# Altium project Mainboard.PrjPcb (part 2 of 2)

## Sheet Power.SchDoc: Наименование
size 420 x 297 mm; ApprovedBy: Утвердил; CheckedBy: Проверил; Author: Разработал; CompanyName: Организация; DrawnBy: Н.Контр; Engineer: Т.Контр; SheetNumber: 1; SheetTotal: 1; PageSetup: Record=PageOptions|CenterHorizontal=True|CenterVertical=True|PrintScale=0.94|XCorrection=1.00|YCorrection=1.00|PrintKind=1|BorderSize=5000000|LeftOffset=0|BottomOffset=0|Orientation=1|PaperLength=1000|PaperWidth=1000|Scale=100|PaperSource=7|PrintQuality=-4|MediaType=1|DitherType=10|PaperKind=A4|PrintScaleMode=1; DecimalNumber: Power; HeadOfSector: Нач. сектора; MainDevice: Перв.примен.; Name: Наименование; DocumentName: Sheet1.SCHDOC
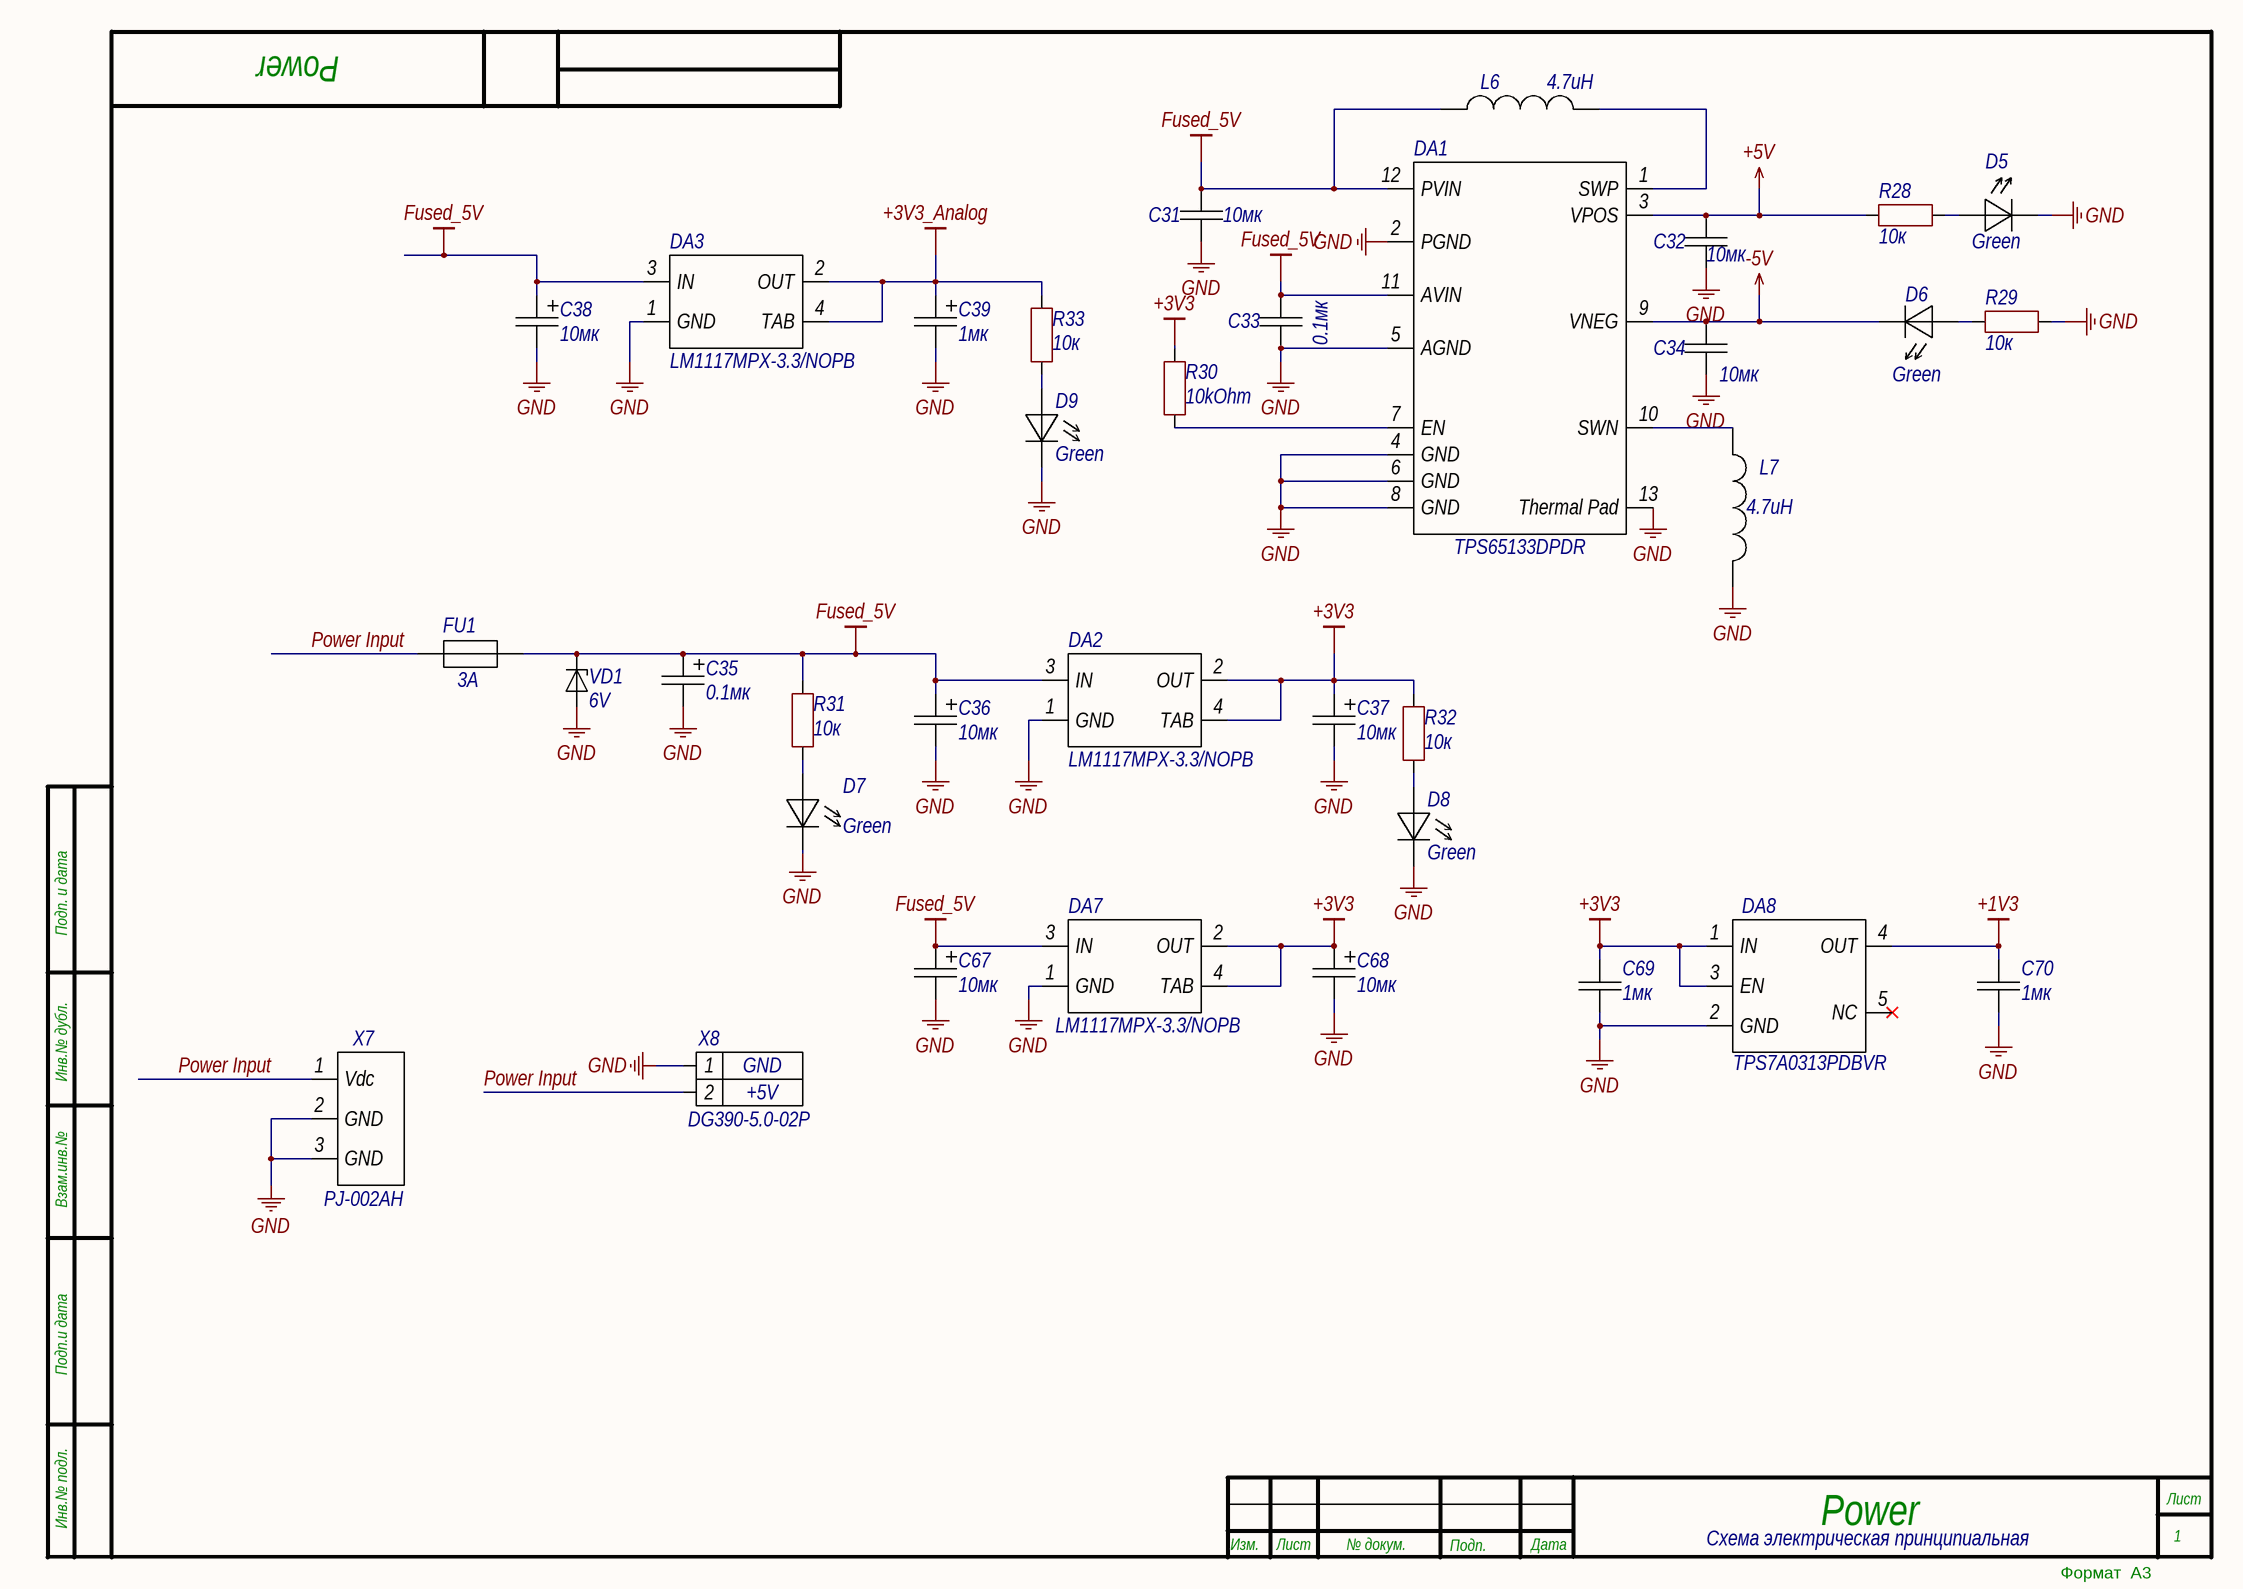
[diagram p5: Power.SchDoc]

### Parts
C31  value 10мк  [CAPC3216N]  (hidden comment: 10мк *)
C32  value 10мк  [CAPC3216N]  (hidden comment: 10мк *)
C33  value 0.1мк  [CAPC3216N]  (hidden comment: 0.1мк *)
C34  value 10мк  [CAPC3216N]  (hidden comment: 10мк *)
C35  value 0.1мк  [TYPEB]  (hidden comment: 0.1мк 10V)
C36  value 10мк  [TYPEA]  (hidden comment: 10мк 16V)
C37  value 10мк  [TYPEA]  (hidden comment: 10мк 16V)
C38  value 10мк  [TYPEA]  (hidden comment: 10мк 16V)
C39  value 1мк  [TYPEA]  (hidden comment: 1мк 16V)
C67  10мк  [TYPEA]
C68  10мк  [TYPEA]
C69  value 1мк  [CAP0402]  (hidden comment: 1мк *)
C70  value 1мк  [CAP0402]  (hidden comment: 1мк *)
D5  Green  [LED603]
D6  Green  [LED603]
D7  Green  [LED603]
D8  Green  [LED603]
D9  Green  [LED603]
DA1  TPS65133DPDR  [FP-DPD0012A-IPC_A]
DA2  MPN: LM1117MPX-3.3/NOPB  [SOT-223]  (hidden comment: LDO 5V to 3V3)
DA3  MPN: LM1117MPX-3.3/NOPB  [SOT-223]  (hidden comment: LDO 5V to 3V3)
DA7  LM1117MPX-3.3/NOPB  [SOT-223]
DA8  TPS7A0313PDBVR  [SOT-23-5]
FU1  value 3A  [FP-0154-MFG]  (hidden comment: Fuse: +5V power line)
L6  4.7uH  [ind_SRN8040]
L7  4.7uH  [ind_SRN8040]
R28  10к  [RESC0603N]
R29  10к  [RESC0603N]
R30  value 10kOhm  [RESC0603N]  (hidden comment: 10kOhm 0.1W)
R31  value 10к  [RESC0603N]  (hidden comment: 10к 0.1W)
R32  10к  [RESC0603N]
R33  10к  [RESC0603N]
VD1  value 6V  [DO-214AA]  (hidden comment: TVS: +5V power line)
X7  PJ-002AH  [PJ-002AH]
X8  DG390-5.0-02P  Wire2: +5V  Wire1: GND  [DG390-5.0-02P]

### Nets
+1V3: C70.2 DA8.4(OUT)
+3V3: C37.1 C68.1 C69.2 DA2.2(OUT) DA2.4(TAB) DA7.2(OUT) DA7.4(TAB) DA8.1(IN) DA8.3(EN) R30.2 R32.2
+3V3_Analog: C39.1 DA3.2(OUT) DA3.4(TAB) R33.2
+5V: C32.2 DA1.3(VPOS) R28.1
-5V: C34.2 D6.1(A) DA1.9(VNEG)
Fused_5V: C31.2 C33.2 C35.1 C36.1 C38.1 C67.1 DA1.11(AVIN) DA1.12(PVIN) DA2.3(IN) DA3.3(IN) DA7.3(IN) FU1.2 L6.1 R31.2 VD1.1
GND: C31.1 C32.1 C33.1 C34.1 C35.2 C36.2 C37.2 C38.2 C39.2 C67.2 C68.2 C69.1 C70.1 D5.1(A) D7.1(A) D8.1(A) D9.1(A) DA1.2(PGND) DA1.4(GND) DA1.5(AGND) DA1.6(GND) DA1.8(GND) DA1.13(Thermal_Pad) DA2.1(GND) DA3.1(GND) DA7.1(GND) DA8.2(GND) L7.2 R29.2 VD1.2 X7.2(GND) X7.3(GND) X8.1
Power Input: FU1.1 X7.1(Vdc) X8.2
NetD5_2: D5.2(K) R28.2
NetD6_2: D6.2(K) R29.1
NetD7_2: D7.2(K) R31.1
NetD8_2: D8.2(K) R32.1
NetD9_2: D9.2(K) R33.1
NetDA1_1: DA1.1(SWP) L6.2
NetDA1_7: DA1.7(EN) R30.1
NetDA1_10: DA1.10(SWN) L7.1

Not connected (* = marked no-connect by the designer): DA8 5(NC)*

### Notes on the sheet
- Схема электрическая принципиальная
- Подп. и дата
- Инв.№ дубл.
- Взам.инв.№
- Подп.и дата
- Инв.№ подл.
- Изм.
- Лист
- № докум.
- Подп.
- Дата
- Формат  A3

### Library data of the parts
C31-C34 = CAPC: MntType: SMD; MSL: MSL 1; Package: =Footprint; RoHS: Comply; PartType: CHIP CERAMIC CAPACITOR; Pins: 2; BOMDescription: =MntType+' '+PartType+' '+Package+' '+Value+' '+Tolerance+' '+Voltage+' '+TempCoeff+' '+MPN; CFootprint: =Footprint; Voltage: *; Part Number: CAPC; ClassName: Capacitor; ComponentLink1Description: Datasheet
C35 = Cap TANTAL: Manufacturer: KEMET; ManufacturerAlt: JLCPCB; MPN: T491B107M010AT; MPNAlt: C90975; MntType: SMD; Tolerance: 20%; Height: 1.9mm; MSL: MSL 1; Package: =Footprint; RoHS: Comply; Weight: 107.45mg; Voltage: 10V; PartType: CHIP TANTALUM CAPACITOR; Pins: 2; BOMDescription: =MntType+' '+PartType+' '+Package+' '+Value+' '+Tolerance+' '+Voltage+' '+TempCoeff+' '+MPN; CFootprint: =Footprint; Part Number: Cap TANTAL; ClassName: Capacitor; ComponentLink1Description: Datasheet; ComponentLink1Description: New link; ComponentLink1URL: https://content.kemet.com/datasheets/KEM_T2005_T491.pdf
C36-C39 = Cap TANTAL: Manufacturer: AVX; ManufacturerAlt: JLCPCB; MPN: TAJA106K016RNJ; MPNAlt: C7171; MntType: SMD; Tolerance: 10%; Height: 1.60; MSL: MSL 1; Package: =Footprint; RoHS: Comply; Voltage: 16V; PartType: CHIP TANTALUM CAPACITOR; Pins: 2; BOMDescription: =MntType+' '+PartType+' '+Package+' '+Value+' '+Tolerance+' '+Voltage+' '+TempCoeff+' '+MPN; CFootprint: =Footprint; Part Number: Cap TANTAL; ClassName: Capacitor; ComponentLink1Description: Datasheet; ComponentLink1Description: New link; ComponentLink1URL: https://datasheets.kyocera-avx.com/TAJ.pdf
C67 C68 = Cap TANTAL: MntType: SMD; MSL: MSL 1; Package: =Footprint; RoHS: Comply; PartType: CHIP TANTALUM CAPACITOR; Pins: 2; BOMDescription: =MntType+' '+PartType+' '+Package+' '+Value+' '+Tolerance+' '+Voltage+' '+TempCoeff+' '+MPN; CFootprint: =Footprint; Value: 10мк; PART NUMBER: Cap TANTAL; CLASSNAME: Capacitor; COMPONENTLINK1DESCRIPTION: Datasheet
C69 C70 = CAP0402: MntType: SMD; MSL: MSL 1; Package: =Footprint; RoHS: Comply; PartType: CHIP CERAMIC CAPACITOR; Pins: 2; BOMDescription: =MntType+' '+PartType+' '+Package+' '+Value+' '+Tolerance+' '+Voltage+' '+TempCoeff+' '+MPN; CFootprint: =Footprint; Voltage: *; PART NUMBER: CAP0402; CLASSNAME: Capacitor; COMPONENTLINK1DESCRIPTION: Datasheet
D5 D6 D8 D9 = LEDC: MntType: SMD; MSL: MSL 5; Package: =Footprint; RoHS: Comply; PartType: CHIP LED; Pins: 2; BOMDescription: =MntType+' '+PartType+' '+Package+' '+Value+' '+Tolerance+' '+Voltage+' '+TempCoeff+' '+MPN; CFootprint: =Footprint; Value: Green; PART NUMBER: LEDC; CLASSNAME: LED; COMPONENTLINK1DESCRIPTION: Datasheet
D7 = LEDC: Manufacturer: Everlight Elec; ManufacturerAlt: JLCPCB; MPN: 19-217/GHC-YR1S2/3T; MPNAlt: C72043; MntType: SMD; Power: 110mW; Voltage: 3.3V; Height: 0.4 mm; MSL: MSL 5; Package: =Footprint; RoHS: Comply; Weight: 118.61 mg; PartType: CHIP LED; Pins: 2; BOMDescription: =MntType+' '+PartType+' '+Package+' '+Value+' '+Tolerance+' '+Voltage+' '+TempCoeff+' '+MPN; CFootprint: =Footprint; Value: Green; Part Number: LEDC; ClassName: LED; ComponentLink1Description: Datasheet; ComponentLink1Description: New link; ComponentLink1URL: https://datasheet.lcsc.com/lcsc/1811101510_Everlight-Elec-19-217-GHC-YR1S2-3T_C72043.pdf
DA1 = TPS65133DPDR: Dual-Output Power Supply; Manufacturer: TI; Number of Channels: 2; Max Supply Voltage: 5V; Min Supply Voltage: 2.9V; Output Voltage: -5V; MntType: SMD; Mount: Surface Mount; Case/Package: QFN; Packaging: Tape and Reel; Lead Free: Lead Free; Radiation Hardening: No; Min Operating Temperature: -40°C; Number of Outputs: 2; Max Operating Temperature: 85°C; Number of Pins: 12; RoHS Compliant: Yes; Package Quantity: 3000; Part Number: TPS65133DPDR; Value: TPS65133DPDR; MPN: TPS65133DPDR; MSL: MSL 1; Package: WSON; RoHS: Comply; PartType: Switch Power; Pins: 13; BOMDescription: =MntType+' '+PartType+' '+Package+' '+Value+' '+Tolerance+' '+Voltage+' '+TempCoeff+' '+MPN; CFootprint: =Footprint; ClassName: Switch Power; ComponentLink1Description: Datasheet; ComponentLink1URL: https://www.ti.com/lit/ds/symlink/tps65133.pdf?ts=1627858987235&ref_url=https%253A%252F%252Fwww.google.com%252F
DA2 DA3 = LM1117MPX-3.3/NOPB: Manufacturer: Texas Instruments; ManufacturerAlt: JLCPCB; MPNAlt: C9662; BOMDescription: SMD LDO SOT-223 3.3V  15V  LM1117MPX-3.3/NOPB; MntType: SMD; Value: 3.3V; Voltage: 15V; CFootprint: =Footprint; Height: 35.0; MSL: MSL 1; Package: SOT-223; PartType: LDO; Pins: 4; RoHS: Comply; Part Number: LM1117MPX-3.3/NOPB; Weight: 290 mg; ClassName: LDO; ComponentLink1Description: Datasheet; ComponentLink1URL: https://www.ti.com/lit/ds/symlink/lm1117.pdf
DA7 = LM1117MPX-3.3/NOPB: Manufacturer: Texas Instruments; MPNAlt: C9662; BOMDescription: SMD LDO SOT-223 3.3V  3.3V  LM1117MPX-3.3/NOPB; MntType: SMD; Value: 3.3V; CFootprint: =Footprint; Height: 1,8; MPN: LM1117MPX-3.3/NOPB; MSL: MSL 1; Package: SOT-223; PartType: LDO; Pins: 4; RoHS: Comply; Voltage: 3.3V; PART NUMBER: LM1117MPX-3.3/NOPB; WEIGHT: 290 mg; CLASSNAME: LDO; COMPONENTLINK1DESCRIPTION: Datasheet; COMPONENTLINK1URL: https://www.ti.com/lit/ds/symlink/lm1117.pdf
DA8 = TPS7A0313PDBVR: Manufacturer: TI; Value: 1.3 V; MntType: SMD; MSL: MSL 1; Package: =Footprint; RoHS: Comply; PartType: LDO; Pins: 5; BOMDescription: =MntType+' '+PartType+' '+Package+' '+Value+' '+Tolerance+' '+Voltage+' '+TempCoeff+' '+MPN; CFootprint: =Footprint; ClassName: LDO; ComponentLink1Description: Datasheet; MPN: TPS7A0313PDBVR; PART NUMBER: TPS7A0313PDBVR; COMPONENTLINK1URL: https://www.ti.com/lit/ds/symlink/tps7a03.pdf
FU1 = 0154003.DR: Manufacturer: Littelfuse; ManufacturerAlt: JLCPCB; MPNAlt: C206912; MntType: SMD; Voltage: 125 V; Part Number: 0154003.DR; MPN: 0154003.DR; Height: 3.81 mm; MSL: MSL 1; Package: OMNI-BLOK; RoHS: Comply; Weight: 819.8 mg; PartType: Fuse; Pins: 2; BOMDescription: =MntType+' '+PartType+' '+Package+' '+Value+' '+Tolerance+' '+Voltage+' '+TempCoeff+' '+MPN; CFootprint: =Footprint; ComponentLink1Description: Datasheet; ComponentLink1URL: https://www.littelfuse.com/media?resourcetype=datasheets&itemid=1cd64ad0-b793-4012-8c75-7e2fefbc1368&filename=littelfuse-fuse-154-154t-154l-154tl-datasheet.pdf
L6 L7 = SRN8040-4R7Y: Manufacturer: Bourns; MntType: SMD; MPN: SRN8040-4R7Y; MSL: MSL 1; Package: =Footprint; RoHS: Comply; PartType: INDUCTOR; Pins: 2; BOMDescription: =MntType+' '+PartType+' '+Package+' '+Value+' '+Tolerance+' '+Voltage+' '+TempCoeff+' '+MPN; CFootprint: =Footprint; Value: 4.7uH; Part Number: SRN8040-4R7Y; ClassName: Inductor; ComponentLink1Description: Datasheet; ComponentLink1URL: https://spb.terraelectronica.ru/pdf/show?pdf_file=http%253A%252F%252Fwww.farnell.com%252Fdatasheets%252F1927816.pdf
R28 R29 R32 R33 = RES: MntType: SMD; MSL: MSL 1; Package: =Footprint; RoHS: Comply; PartType: CHIP RESISTOR; Pins: 2; BOMDescription: =MntType+' '+PartType+' '+Package+' '+Value+' '+Tolerance+' '+Voltage+' '+TempCoeff+' '+MPN; CFootprint: =Footprint; Value: 10к; PART NUMBER: RES; CLASSNAME: Resistor; COMPONENTLINK1DESCRIPTION: Datasheet
R30 R31 = RES: Manufacturer: UNI-ROYAL(Uniroyal Elec); ManufacturerAlt: JLCPCB; MPN: 0603WAF1002T5E; MPNAlt: C25804; MntType: SMD; Tolerance: 1%; Voltage: 75V; Height: 0.45; MSL: MSL 1; Package: =Footprint; Power: 0.1W; RoHS: Comply; PartType: CHIP RESISTOR; Pins: 2; BOMDescription: =MntType+' '+PartType+' '+Package+' '+Value+' '+Tolerance+' '+Voltage+' '+TempCoeff+' '+MPN; CFootprint: =Footprint; Part Number: RES; ClassName: Resistor; ComponentLink1Description: Datasheet; ComponentLink1Description: New link; ComponentLink1URL: https://datasheet.lcsc.com/lcsc/1811062009_UNI-ROYAL-Uniroyal-Elec-0603WAF1002T5E_C25804.pdf
VD1 = SMBJ6.0A: Manufacturer: RUILON(Shenzhen Ruilongyuan Elec); ManufacturerAlt: JLCPCB; MPNAlt: C10205; MntType: SMD; Power: 5W; Tolerance: 5%; Part Number: SMBJ6.0A; MPN: SMBJ6.0A; Height: 2.610 mm; MSL: MSL 1; Package: DO-214AA; RoHS: Comply; Weight: 93 mg; Voltage: 6V; PartType: Diode_zener; Pins: 2; BOMDescription: =MntType+' '+PartType+' '+Package+' '+Value+' '+Tolerance+' '+Voltage+' '+TempCoeff+' '+MPN; CFootprint: =Footprint; ClassName: Diode_zener; ComponentLink1Description: Datasheet; ComponentLink1URL: https://www.littelfuse.com/~/media/electronics/datasheets/tvs_diodes/littelfuse_tvs_diode_smbj_datasheet.pdf.pdf; ComponentLink2Description: Datasheet 2; ComponentLink2URL: https://datasheet.lcsc.com/lcsc/1809050331_RUILON-Shenzhen-Ruilongyuan-Elec-SMBJ6.0A_C10205.pdf
X7 = CUI_PJ-002AH: Manufacturer: CUI; MntType: DIP; MPN: PJ-002AH; MSL: MSL 1; Package: =Footprint; RoHS: Comply; PartType: CONNECTOR; Pins: 3; BOMDescription: =MntType+' '+PartType+' '+Package+' '+Value+' '+Tolerance+' '+Voltage+' '+TempCoeff+' '+MPN; CFootprint: =Footprint; Part Number: CUI_PJ-002AH
X8 = DG390-5.0-02P: Manufacturer: DEGSON; MntType: DIP; System: Connector; Part Number: DG390-5.0-02P; Value: DG390-5.0-02P; MPN: DG390-5.0-02P; MSL: MSL 1; RoHS: Comply; PartType: CONNECTOR; Pins: 2; BOMDescription: =MntType+' '+PartType+' '+Package+' '+Value+' '+Tolerance+' '+Voltage+' '+TempCoeff+' '+MPN; CFootprint: =Footprint; ClassName: Connector; ComponentLink1Description: Datasheet; ComponentLink1URL: https://www.degson.com/content/details_552_878975.html?lang=en

## Sheet Comparator.SchDoc: Наименование
size 420 x 297 mm; ApprovedBy: Утвердил; CheckedBy: Проверил; Author: Разработал; CompanyName: Организация; DrawnBy: Н.Контр; Engineer: Т.Контр; SheetNumber: 1; SheetTotal: 1; PageSetup: Record=PageOptions|CenterHorizontal=True|CenterVertical=True|PrintScale=0.94|XCorrection=1.00|YCorrection=1.00|PrintKind=1|BorderSize=5000000|LeftOffset=0|BottomOffset=0|Orientation=1|PaperLength=1000|PaperWidth=1000|Scale=100|PaperSource=7|PrintQuality=-4|MediaType=1|DitherType=10|PaperKind=A4|PrintScaleMode=1; DecimalNumber: Comparator; HeadOfSector: Нач. сектора; MainDevice: Перв.примен.; Name: Наименование; DocumentName: Sheet1.SCHDOC
Used 2 times, as channels A13, A14. Parts and nets are listed once, with the designators drawn on the sheet.
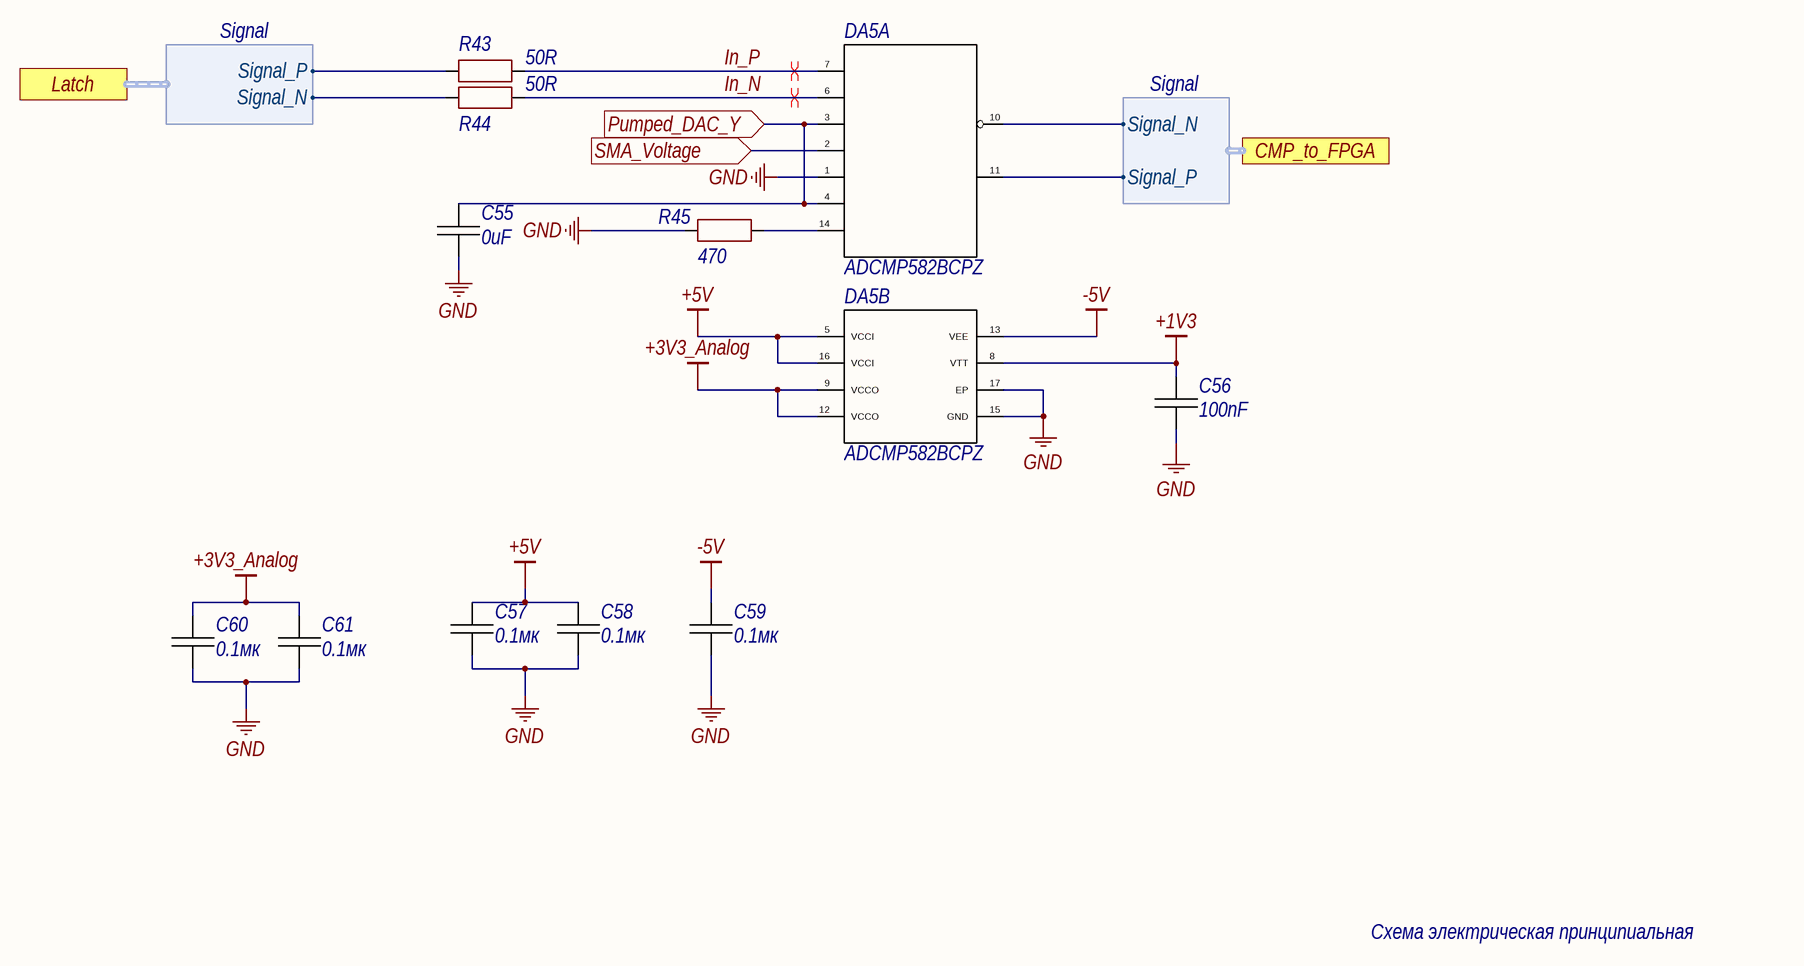
[diagram p6: Comparator.SchDoc]

### Parts
C55  value 0uF  [CAP0402]  (hidden comment: 0uF 50V)
C56  value 100nF  [CAP0402]  (hidden comment: 100nF 50V)
C57  value 0.1мк  [CAP0402]  (hidden comment: 0.1мк 50V)
C58  value 0.1мк  [CAP0402]  (hidden comment: 0.1мк 50V)
C59  value 0.1мк  [CAP0402]  (hidden comment: 0.1мк 50V)
C60  value 0.1мк  [CAP0402]  (hidden comment: 0.1мк 50V)
C61  value 0.1мк  [CAP0402]  (hidden comment: 0.1мк 50V)
DA5  (no value)  [ADI-CP-16-3_N]  (parts A,B of 2)
R43  50R  [RESC0402(1005)_M]
R44  50R  [RESC0402(1005)_M]
R45  470  [RESC0402(1005)_M]

### Ports
CMP_to_FPGA (harness Signal), Latch (harness Signal), Pumped_DAC_Y (in), SMA_Voltage (in)

### Harnesses
Signal: Signal_N, Signal_P

### Nets
+1V3: C56.2 DA5.8(VTT)
+3V3_Analog: C60.1 C61.1 DA5.9(VCCO) DA5.12(VCCO)
+5V: C57.1 C58.1 DA5.5(VCCI) DA5.16(VCCI)
-5V: C59.1 DA5.13(VEE)
GND: C55.2 C56.1 C57.2 C58.2 C59.2 C60.2 C61.2 DA5.1(VTP) DA5.15(GND) DA5.17(EP) R45.1
In_N: DA5.6(~{LE}) R44.1
In_P: DA5.7(LE) R43.1
Pumped_DAC_Y: C55.1 DA5.3(VN) DA5.4(VTN) ; port Pumped_DAC_Y
SMA_Voltage: DA5.2(VP) ; port SMA_Voltage
NetDA5_10: DA5.10(~{Q}) ; port CMP_to_FPGA.Signal_N
NetDA5_11: DA5.11(Q) ; port CMP_to_FPGA.Signal_P
NetDA5_14: DA5.14(HYS) R45.2
NetR43_2: R43.2 ; port Latch.Signal_P
NetR44_2: R44.2 ; port Latch.Signal_N

### Channels
A13: designators C55=A13.C55 C56=A13.C56 C57=A13.C57 C58=A13.C58 C59=A13.C59 C60=A13.C60 C61=A13.C61 DA5=A13.DA5 R43=A13.R43 R44=A13.R44 R45=A13.R45; ports Pumped_DAC_Y=NetA13.C55_1 SMA_Voltage=SMA_Voltage_1
A14: designators C55=A14.C55 C56=A14.C56 C57=A14.C57 C58=A14.C58 C59=A14.C59 C60=A14.C60 C61=A14.C61 DA5=A14.DA5 R43=A14.R43 R44=A14.R44 R45=A14.R45; ports Pumped_DAC_Y=NetA14.C55_1 SMA_Voltage=SMA_Voltage_2

### Layout directives
differential pair; differential pair class LVDS/PECL: In_N_A13, In_P_A13

### Notes on the sheet
- Схема электрическая принципиальная
- Подп. и дата
- Инв.№ дубл.
- Взам.инв.№
- Подп.и дата
- Инв.№ подл.
- Изм.
- Лист
- № докум.
- Подп.
- Дата
- Формат  A3

### Library data of the parts
C55-C61 = CAP0402: Manufacturer: Samsung Electro-Mechanics; ManufacturerAlt: JLCPCB; MPN: CL05B104KB54PNC; MPNAlt: C307331; MntType: SMD; Notes: Basic Part; Tolerance: 10%; Height: 0.5mm; MSL: MSL 1; Package: =Footprint; RoHS: Comply; Weight: 1.500mg; PartType: CHIP CERAMIC CAPACITOR; Pins: 2; BOMDescription: =MntType+' '+PartType+' '+Package+' '+Value+' '+Tolerance+' '+Voltage+' '+TempCoeff+' '+MPN; CFootprint: =Footprint; Voltage: 50V; Part Number: CAP0402; ClassName: Capacitor; ComponentLink1Description: Datasheet; ComponentLink1Description: New link; ComponentLink1URL: https://datasheet.lcsc.com/lcsc/1810191222_Samsung-Electro-Mechanics-CL05B104KB54PNC_C307331.pdf
DA5 = ADCMP582BCPZ: Ultrafast SiGe Voltage Comparator, + / - 5 V, 180 ps Delay, Industrial, 16-pin QFN (CP-16-3), Reel; MANUFACTURER: AD; MNTTYPE: SMD; MPN: ADCMP582BCPZ; PART NUMBER: ADCMP582BCPZ; MSL: MSL 1; PACKAGE: LFCSP-16; ROHS: Comply; PARTTYPE: Comparator; PINS: 16; BOMDESCRIPTION: =MntType+' '+PartType+' '+Package+' '+Value+' '+Tolerance+' '+Voltage+' '+TempCoeff+' '+MPN; CFOOTPRINT: =Footprint; CLASSNAME: Comparator; COMPONENTLINK1DESCRIPTION: Datasheet; COMPONENTLINK1URL: https://www.analog.com/media/en/technical-documentation/data-sheets/ADCMP580_581_582.pdf
R43 R44 = RES0402: MntType: SMD; MSL: MSL 1; Package: =Footprint; RoHS: Comply; PartType: CHIP RESISTOR; Pins: 2; BOMDescription: =MntType+' '+PartType+' '+Package+' '+Value+' '+Tolerance+' '+Voltage+' '+TempCoeff+' '+MPN; CFootprint: =Footprint; Value: 50R; Part Number: RES0402; ClassName: Resistor; ComponentLink1Description: Datasheet
R45 = RES0402: Manufacturer: UNI-ROYAL(Uniroyal Elec); ManufacturerAlt: JLCPCB; MPN: 0402WGF4700TCE; MPNAlt: C25117; MntType: SMD; Tolerance: 1%; MSL: MSL 1; Package: =Footprint; RoHS: Comply; PartType: CHIP RESISTOR; Pins: 2; BOMDescription: =MntType+' '+PartType+' '+Package+' '+Value+' '+Tolerance+' '+Voltage+' '+TempCoeff+' '+MPN; CFootprint: =Footprint; Value: 470; Part Number: RES0402; ClassName: Resistor; ComponentLink1Description: Datasheet

## Sheet DelayLine.SchDoc: Наименование
size 420 x 297 mm; ApprovedBy: Утвердил; CheckedBy: Проверил; Author: Разработал; CompanyName: Организация; DrawnBy: Н.Контр; Engineer: Т.Контр; SheetNumber: 1; SheetTotal: 1; PageSetup: Record=PageOptions|CenterHorizontal=True|CenterVertical=True|PrintScale=0.94|XCorrection=1.00|YCorrection=1.00|PrintKind=1|BorderSize=5000000|LeftOffset=0|BottomOffset=0|Orientation=1|PaperLength=1000|PaperWidth=1000|Scale=100|PaperSource=7|PrintQuality=-4|MediaType=1|DitherType=10|PaperKind=A4|PrintScaleMode=1; DecimalNumber: DelayLine; HeadOfSector: Нач. сектора; MainDevice: Перв.примен.; Name: Наименование; DocumentName: Sheet1.SCHDOC
Used 2 times, as channels A10, A12. Parts and nets are listed once, with the designators drawn on the sheet.
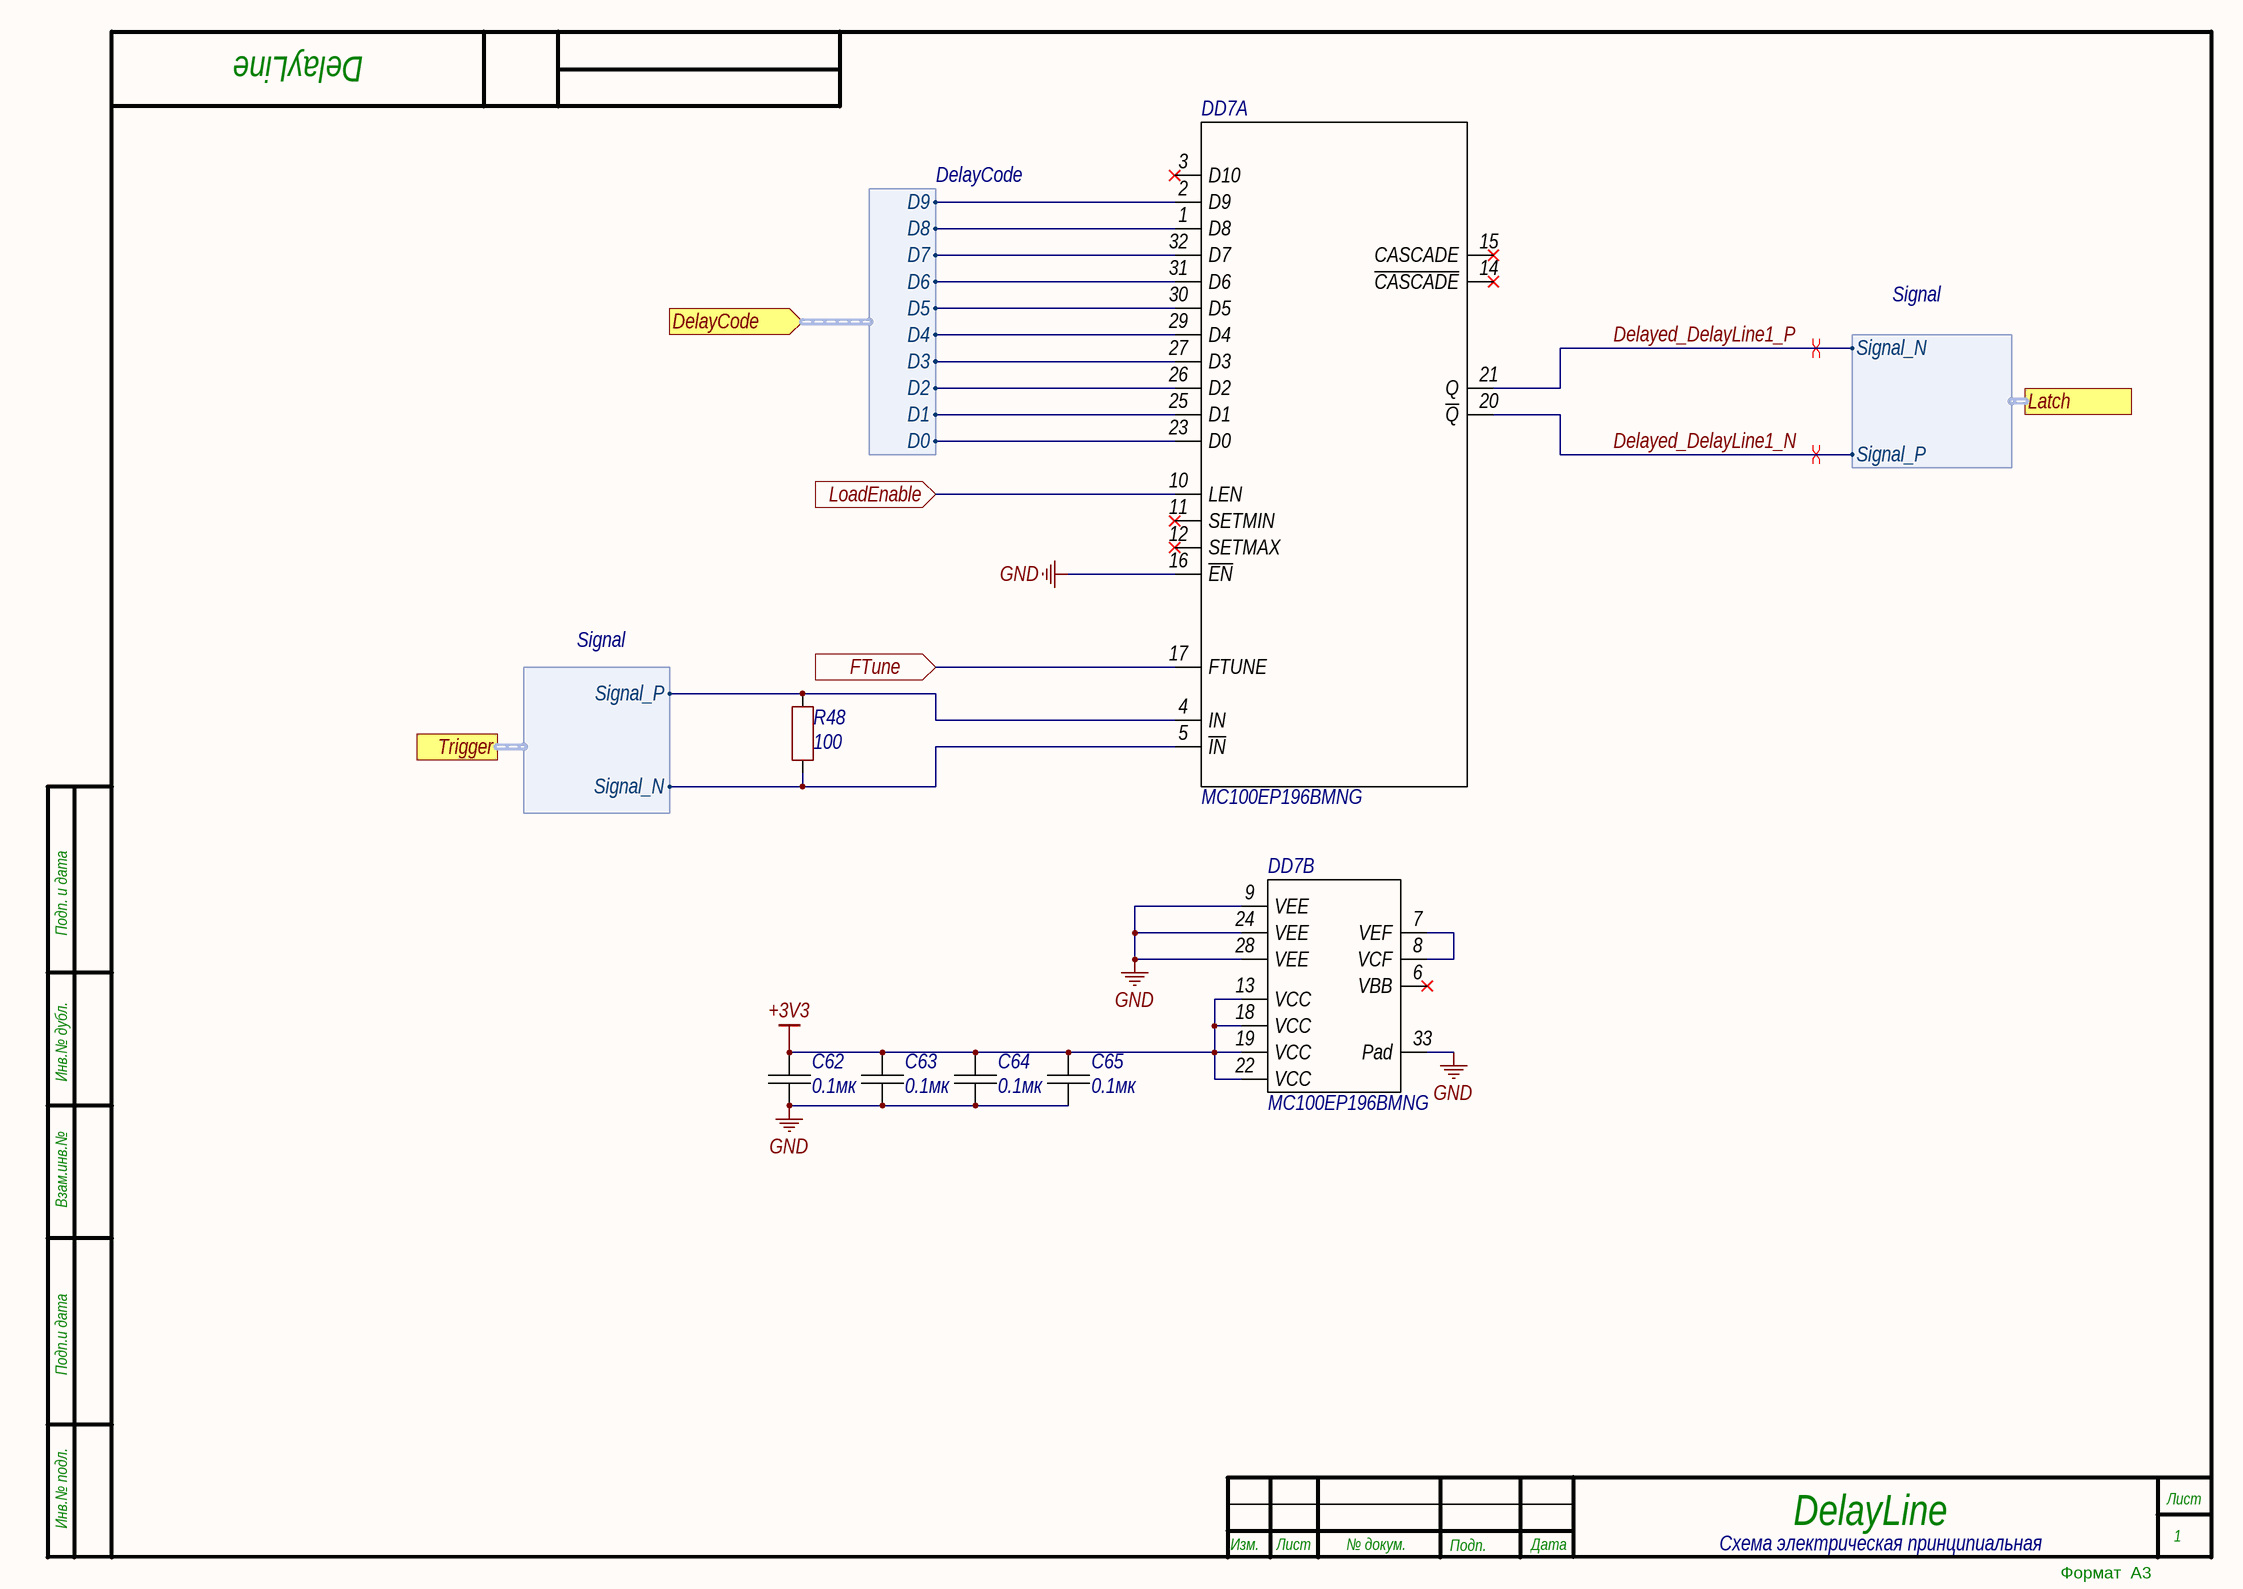
[diagram p7: DelayLine.SchDoc]

### Parts
C62  value 0.1мк  [CAP0402]  (hidden comment: 0.1мк *)
C63  value 0.1мк  [CAP0402]  (hidden comment: 0.1мк *)
C64  value 0.1мк  [CAP0402]  (hidden comment: 0.1мк *)
C65  value 0.1мк  [CAP0402]  (hidden comment: 0.1мк *)
DD7  MC100EP196BMNG  [QFN-32_N_TP]  (parts A,B of 2)
R48  100  [RESC0402(1005)_M]

### Ports
DelayCode (in, harness DelayCode), FTune (in), Latch (harness Signal), LoadEnable (in), Trigger (harness Signal)

### Harnesses
Signal: Signal_P, Signal_N
Signal: Signal_N, Signal_P
DelayCode: D9, D8, D7, D6, D5, D4, D3, D2, D1, D0

### Nets
+3V3: C62.1 C63.1 C64.1 C65.1 DD7.13(VCC) DD7.18(VCC) DD7.19(VCC) DD7.22(VCC)
GND: C62.2 C63.2 C64.2 C65.2 DD7.9(VEE) DD7.16(~{EN}) DD7.24(VEE) DD7.28(VEE) DD7.33(Pad)
Delayed_DelayLine1_N: DD7.20(~{Q}) ; port Latch.Signal_P
Delayed_DelayLine1_P: DD7.21(Q) ; port Latch.Signal_N
FTune: DD7.17(FTUNE) ; port FTune
LoadEnable: DD7.10(LEN) ; port LoadEnable
NetDD7_1: DD7.1(D8) ; port DelayCode.D8
NetDD7_2: DD7.2(D9) ; port DelayCode.D9
NetDD7_4: DD7.4(IN) R48.2 ; port Trigger.Signal_P
NetDD7_5: DD7.5(~{IN}) R48.1 ; port Trigger.Signal_N
NetDD7_7: DD7.7(VEF) DD7.8(VCF)
NetDD7_23: DD7.23(D0) ; port DelayCode.D0
NetDD7_25: DD7.25(D1) ; port DelayCode.D1
NetDD7_26: DD7.26(D2) ; port DelayCode.D2
NetDD7_27: DD7.27(D3) ; port DelayCode.D3
NetDD7_29: DD7.29(D4) ; port DelayCode.D4
NetDD7_30: DD7.30(D5) ; port DelayCode.D5
NetDD7_31: DD7.31(D6) ; port DelayCode.D6
NetDD7_32: DD7.32(D7) ; port DelayCode.D7

Not connected (* = marked no-connect by the designer): DD7 3(D10)* 6(VBB)* 11(SETMIN)* 12(SETMAX)* 14(~{CASCADE})* 15(CASCADE)*

### Channels
A10: designators C62=A10.C62 C63=A10.C63 C64=A10.C64 C65=A10.C65 DD7=A10.DD7 R48=A10.R48; ports FTune=NetA6.DA4_3 LoadEnable=Enable_1
A12: designators C62=A12.C62 C63=A12.C63 C64=A12.C64 C65=A12.C65 DD7=A12.DD7 R48=A12.R48; ports FTune=NetA9.DA4_3 LoadEnable=Enable_2

### Layout directives
differential pair; differential pair class LVDS/PECL: Delayed_DelayLine1_N, Delayed_DelayLine1_P

### Notes on the sheet
- Схема электрическая принципиальная
- Подп. и дата
- Инв.№ дубл.
- Взам.инв.№
- Подп.и дата
- Инв.№ подл.
- Изм.
- Лист
- № докум.
- Подп.
- Дата
- Формат  A3

### Library data of the parts
C62-C65 = CAP0402: MntType: SMD; MSL: MSL 1; Package: =Footprint; RoHS: Comply; PartType: CHIP CERAMIC CAPACITOR; Pins: 2; BOMDescription: =MntType+' '+PartType+' '+Package+' '+Value+' '+Tolerance+' '+Voltage+' '+TempCoeff+' '+MPN; CFootprint: =Footprint; Voltage: *; Part Number: CAP0402; ClassName: Capacitor; ComponentLink1Description: Datasheet
DD7 = MC100EP196BMNG: MANUFACTURER: ONSEMI; MNTTYPE: SMD; MPN: MC100EP196BMNG; PART NUMBER: MC100EP196BMNG; MSL: MSL 1; PACKAGE: QFN-32; ROHS: Comply; PARTTYPE: Delay Line; PINS: 32; BOMDESCRIPTION: =MntType+' '+PartType+' '+Package+' '+Value+' '+Tolerance+' '+Voltage+' '+TempCoeff+' '+MPN; CFOOTPRINT: =Footprint; CLASSNAME: DelayLine; COMPONENTLINK1DESCRIPTION: Datasheet; COMPONENTLINK1URL: https://eu.mouser.com/datasheet/2/308/1/MC100EP196B_D-2315397.pdf
R48 = RES0402: MntType: SMD; MSL: MSL 1; Package: =Footprint; RoHS: Comply; PartType: CHIP RESISTOR; Pins: 2; BOMDescription: =MntType+' '+PartType+' '+Package+' '+Value+' '+Tolerance+' '+Voltage+' '+TempCoeff+' '+MPN; CFootprint: =Footprint; Value: 100; Part Number: RES0402; ClassName: Resistor; ComponentLink1Description: Datasheet

## Sheet OpAmp.SchDoc: Наименование
size 209 x 297 mm; ApprovedBy: Утвердил; CheckedBy: Проверил; Author: Разработал; CompanyName: Организация; DrawnBy: Н.Контр; Engineer: Т.Контр; SheetNumber: 1; SheetTotal: 1; PageSetup: Record=PageOptions|CenterHorizontal=True|CenterVertical=True|PrintScale=0.94|XCorrection=1.00|YCorrection=1.00|PrintKind=1|BorderSize=5000000|LeftOffset=0|BottomOffset=0|Orientation=1|PaperLength=1000|PaperWidth=1000|Scale=100|PaperSource=7|PrintQuality=-4|MediaType=1|DitherType=10|PaperKind=A4|PrintScaleMode=1; DecimalNumber: OpAmp; HeadOfSector: Нач. сектора; MainDevice: Перв.примен.; Name: Наименование; DocumentName: Sheet1.SCHDOC
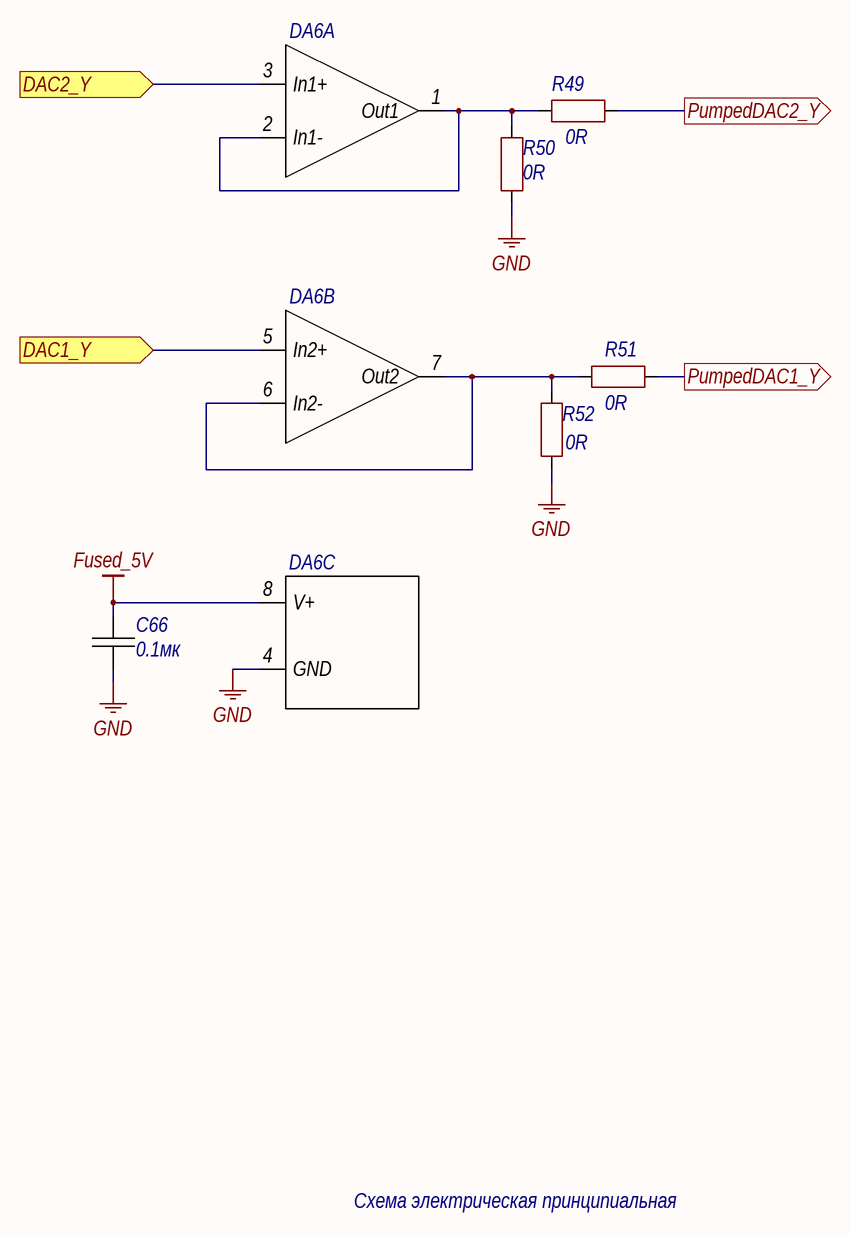
[diagram p8: OpAmp.SchDoc]

### Parts
C66  value 0.1мк  [CAP0402]  (hidden comment: 0.1мк 50V)
DA6  AD8032ARZ  [SOIC-8_M]  (value not drawn)  (parts A,B,C of 3)
R49  0R  [RESC0402(1005)_M]
R50  0R  [RESC0402(1005)_M]
R51  0R  [RESC0402(1005)_M]
R52  0R  [RESC0402(1005)_M]

### Ports
DAC1_Y (in), DAC2_Y (in), PumpedDAC1_Y (out), PumpedDAC2_Y (out)

### Nets
Fused_5V: C66.2 DA6.8(V+)
GND: C66.1 DA6.4(GND) R50.1 R52.1
NetA7.DA4_3: DA6.5(In2+) ; port DAC1_Y
NetA8.DA4_3: DA6.3(In1+) ; port DAC2_Y
NetA13.C55_1: R51.1 ; port PumpedDAC1_Y
NetA14.C55_1: R49.1 ; port PumpedDAC2_Y
NetDA6_1: DA6.1(Out1) DA6.2(In1-) R49.2 R50.2
NetDA6_6: DA6.6(In2-) DA6.7(Out2) R51.2 R52.2

### Notes on the sheet
- Схема электрическая принципиальная
- Подп. и дата
- Инв.№ дубл.
- Взам.инв.№
- Подп.и дата
- Инв.№ подл.
- Изм.
- Лист
- № докум.
- Подп.
- Дата
- Формат  A4

### Library data of the parts
C66 = CAP0402: as C55 on sheet Comparator; Height: 0.5mm; MSL: MSL 1; Package: =Footprint; RoHS: Comply; Weight: 1.500mg; PartType: CHIP CERAMIC CAPACITOR; Pins: 2; BOMDescription: =MntType+' '+PartType+' '+Package+' '+Value+' '+Tolerance+' '+Voltage+' '+TempCoeff+' '+MPN; CFootprint: =Footprint; Voltage: 50V; Part Number: CAP0402; ClassName: Capacitor; ComponentLink1Description: Datasheet; ComponentLink1Description: New link; ComponentLink1URL: https://datasheet.lcsc.com/lcsc/1810191222_Samsung-Electro-Mechanics-CL05B104KB54PNC_C307331.pdf
DA6 = AD8032ARZ: Manufacturer: AD; MntType: SMD; MPN: AD8032ARZ; Part Number: AD8032ARZ; MSL: MSL 1; Package: SOIC-8; RoHS: Cpmply; PartType: Amplifier; Pins: 8; BOMDescription: =MntType+' '+PartType+' '+Package+' '+Value+' '+Tolerance+' '+Voltage+' '+TempCoeff+' '+MPN; CFootprint: =Footprint; ClassName: Amplifier; ComponentLink1Description: Datasheet; ComponentLink1URL: https://eu.mouser.com/datasheet/2/609/AD8031_8032-1502047.pdf
R49-R52 = RES0402: MntType: SMD; MSL: MSL 1; Package: =Footprint; RoHS: Comply; PartType: CHIP RESISTOR; Pins: 2; BOMDescription: =MntType+' '+PartType+' '+Package+' '+Value+' '+Tolerance+' '+Voltage+' '+TempCoeff+' '+MPN; CFootprint: =Footprint; Value: 0R; Part Number: RES0402; ClassName: Resistor; ComponentLink1Description: Datasheet

## Sheet ClockGen.SchDoc: Наименование
size 420 x 297 mm; ApprovedBy: Утвердил; CheckedBy: Проверил; Author: Разработал; CompanyName: Организация; DrawnBy: Н.Контр; Engineer: Т.Контр; SheetNumber: 1; SheetTotal: 1; PageSetup: Record=PageOptions|CenterHorizontal=True|CenterVertical=True|PrintScale=0.94|XCorrection=1.00|YCorrection=1.00|PrintKind=1|BorderSize=5000000|LeftOffset=0|BottomOffset=0|Orientation=1|PaperLength=1000|PaperWidth=1000|Scale=100|PaperSource=7|PrintQuality=-4|MediaType=1|DitherType=10|PaperKind=A4|PrintScaleMode=1; DecimalNumber: ClockGen; HeadOfSector: Нач. сектора; MainDevice: Перв.примен.; Name: Наименование; DocumentName: Sheet1.SCHDOC
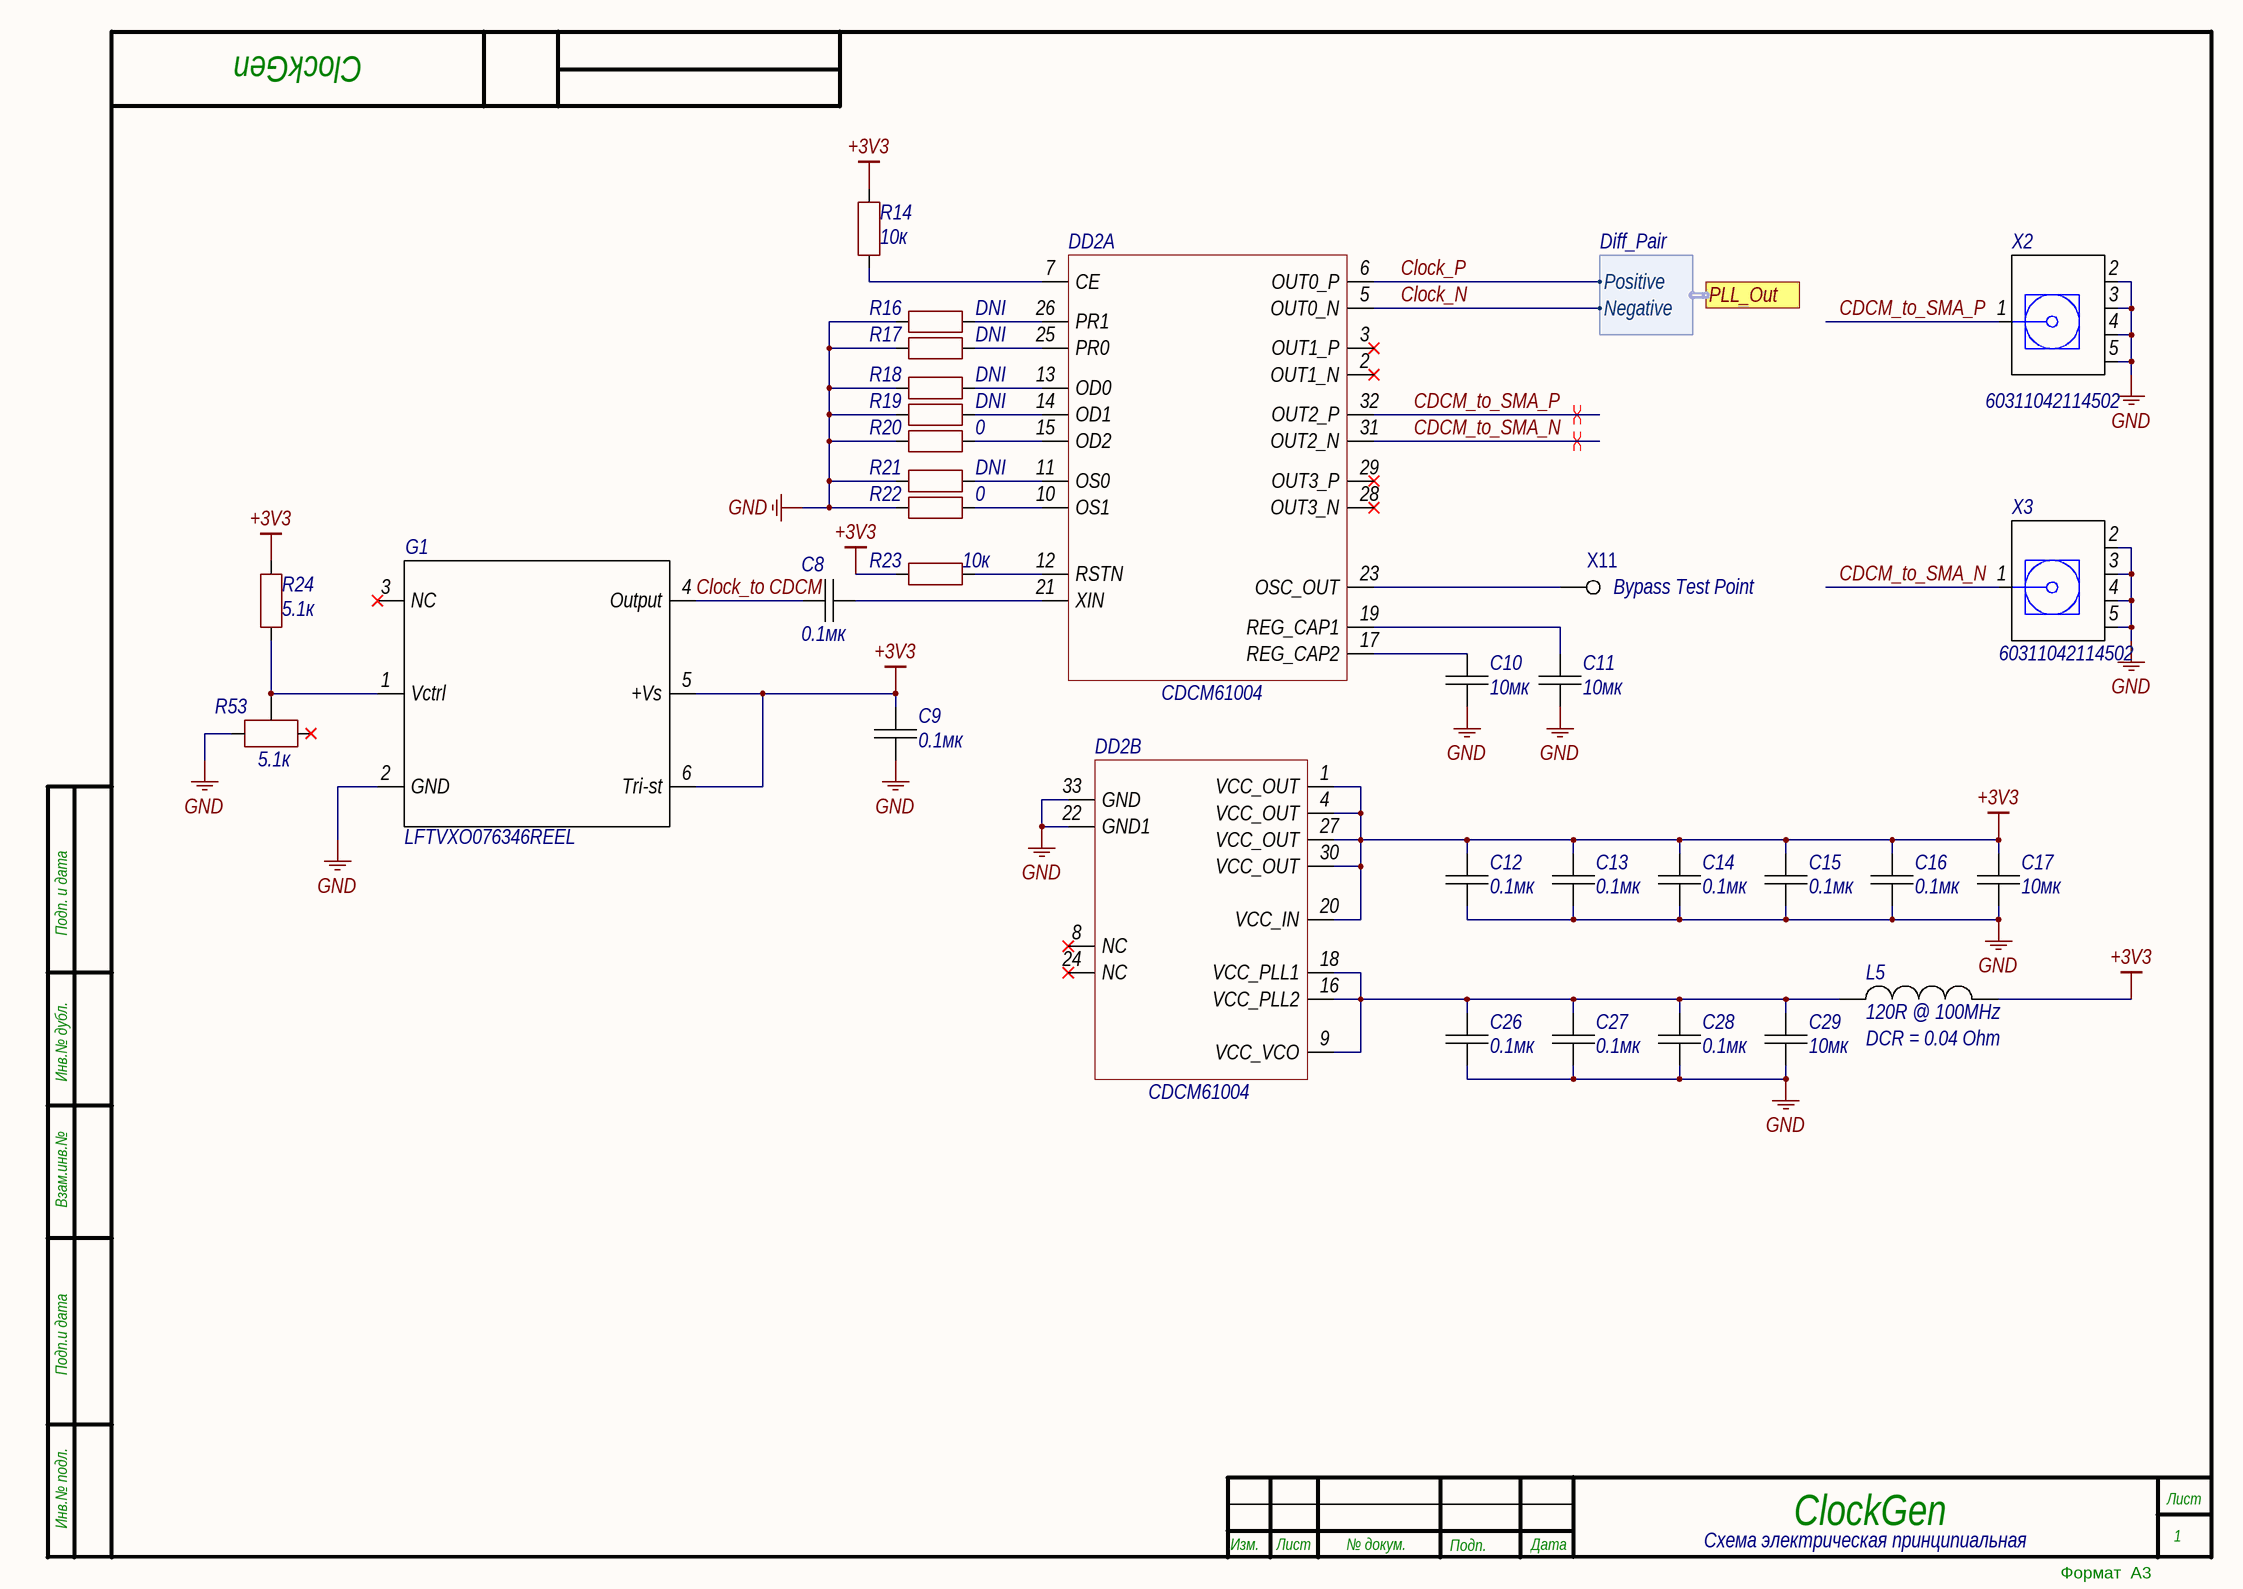
[diagram p9: ClockGen.SchDoc]

### Parts
C8  value 0.1мк  [CAP0402]  (hidden comment: 0.1мк 50V)
C9  value 0.1мк  [CAPC0805N]  (hidden comment: 0.1мк *)
C10  value 10мк  [CAPC0603N]  (hidden comment: 10мк 10V)
C11  value 10мк  [CAPC0603N]  (hidden comment: 10мк 10V)
C12  value 0.1мк  [CAP0402]  (hidden comment: 0.1мк 50V)
C13  value 0.1мк  [CAP0402]  (hidden comment: 0.1мк 50V)
C14  value 0.1мк  [CAP0402]  (hidden comment: 0.1мк 50V)
C15  value 0.1мк  [CAP0402]  (hidden comment: 0.1мк 50V)
C16  value 0.1мк  [CAP0402]  (hidden comment: 0.1мк 50V)
C17  value 10мк  [CAPC0603N]  (hidden comment: 10мк 10V)
C26  value 0.1мк  [CAP0402]  (hidden comment: 0.1мк 50V)
C27  value 0.1мк  [CAP0402]  (hidden comment: 0.1мк 50V)
C28  value 0.1мк  [CAP0402]  (hidden comment: 0.1мк 50V)
C29  value 10мк  [CAPC0603N]  (hidden comment: 10мк 10V)
DD2  CDCM61004  [QFN-32_N_TP]  (parts A,B of 2)
G1  LFTVXO076346REEL  [LFTVXO076346REEL_IQD]
L5  DCR = 0.04 Ohm  value 120R @ 100MHz  [IND-0805_N]
R14  10к  [RESC0402(1005)_M]
R16  DNI  [RESC0402(1005)_M]
R17  DNI  [RESC0402(1005)_M]
R18  DNI  [RESC0402(1005)_M]
R19  DNI  [RESC0402(1005)_M]
R20  0  [RESC0402(1005)_M]
R21  DNI  [RESC0402(1005)_M]
R22  0  [RESC0402(1005)_M]
R23  10к  [RESC0402(1005)_M]
R24  5.1к  [RESC0603N]
R53  value 5.1к  [TRIM_3006P-1-103LF]  (hidden comment: TRIM_3006P-1-103LF)
X2  (no value)  [60311042114502]
X3  (no value)  [60311042114502]
X11  PAD-CONNECT-MINI  [PAD-CONNECT-MINI]  (value not drawn)  (no BOM)

### Ports
PLL_Out (harness Diff_Pair)

### Harnesses
Diff_Pair: Negative, Positive

### Nets
+3V3: C9.2 C12.2 C13.1 C14.1 C15.1 C16.1 C17.2 DD2.1(VCC_OUT) DD2.4(VCC_OUT) DD2.20(VCC_IN) DD2.27(VCC_OUT) DD2.30(VCC_OUT) G1.5(+Vs) G1.6(Tri-st) L5.2 R14.2 R23.2 R24.2
GND: C9.1 C10.1 C11.2 C12.1 C13.2 C14.2 C15.2 C16.2 C17.1 C26.1 C27.2 C28.2 C29.1 DD2.22(GND1) DD2.33(GND) G1.2(GND) R16.1 R17.1 R18.1 R19.1 R20.1 R21.1 R22.1 R53.1 X2.2(GND) X2.3(GND) X2.4(GND) X2.5(GND) X3.2(GND) X3.3(GND) X3.4(GND) X3.5(GND)
CDCM_to_SMA_N: DD2.31(OUT2_N) X3.1(Signal)
CDCM_to_SMA_P: DD2.32(OUT2_P) X2.1(Signal)
Clock_N: DD2.5(OUT0_N) ; port PLL_Out.Negative
Clock_P: DD2.6(OUT0_P) ; port PLL_Out.Positive
Clock_to CDCM: C8.1 G1.4(Output)
NetC8_2: C8.2 DD2.21(XIN)
NetC10_2: C10.2 DD2.17(REG_CAP2)
NetC11_1: C11.1 DD2.19(REG_CAP1)
NetC26_2: C26.2 C27.1 C28.1 C29.2 DD2.9(VCC_VCO) DD2.16(VCC_PLL2) DD2.18(VCC_PLL1) L5.1
NetDD2_7: DD2.7(CE) R14.1
NetDD2_10: DD2.10(OS1) R22.2
NetDD2_11: DD2.11(OS0) R21.2
NetDD2_12: DD2.12(RSTN) R23.1
NetDD2_13: DD2.13(OD0) R18.2
NetDD2_14: DD2.14(OD1) R19.2
NetDD2_15: DD2.15(OD2) R20.2
NetDD2_23: DD2.23(OSC_OUT) X11.1
NetDD2_25: DD2.25(PR0) R17.2
NetDD2_26: DD2.26(PR1) R16.2
NetG1_1: G1.1(Vctrl) R24.1 R53.2

Not connected (* = marked no-connect by the designer): DD2 2(OUT1_N)* 3(OUT1_P)* 8(NC)* 24(NC)* 28(OUT3_N)* 29(OUT3_P)*; G1 3(NC)*; R53 3*

### Layout directives
differential pair; differential pair class LVDS/PECL: CDCM_to_SMA_N, CDCM_to_SMA_P

### Notes on the sheet
- (near X11) Bypass Test Point
- Схема электрическая принципиальная
- Подп. и дата
- Инв.№ дубл.
- Взам.инв.№
- Подп.и дата
- Инв.№ подл.
- Изм.
- Лист
- № докум.
- Подп.
- Дата
- Формат  A3

### Library data of the parts
C8 C12-C16 C26-C28 = CAP0402: as C55 on sheet Comparator; Height: 0.5mm; MSL: MSL 1; Package: =Footprint; RoHS: Comply; Weight: 1.500mg; PartType: CHIP CERAMIC CAPACITOR; Pins: 2; BOMDescription: =MntType+' '+PartType+' '+Package+' '+Value+' '+Tolerance+' '+Voltage+' '+TempCoeff+' '+MPN; CFootprint: =Footprint; Voltage: 50V; Part Number: CAP0402; ClassName: Capacitor; ComponentLink1Description: Datasheet; ComponentLink1Description: New link; ComponentLink1URL: https://datasheet.lcsc.com/lcsc/1810191222_Samsung-Electro-Mechanics-CL05B104KB54PNC_C307331.pdf
C9 = CAPC: MntType: SMD; MSL: MSL 1; Package: =Footprint; RoHS: Comply; PartType: CHIP CERAMIC CAPACITOR; Pins: 2; BOMDescription: =MntType+' '+PartType+' '+Package+' '+Value+' '+Tolerance+' '+Voltage+' '+TempCoeff+' '+MPN; CFootprint: =Footprint; Voltage: *; PART NUMBER: CAPC; CLASSNAME: Capacitor; COMPONENTLINK1DESCRIPTION: Datasheet
C10 C11 C17 C29 = CAPC: Manufacturer: Samsung Electro-Mechanics; ManufacturerAlt: JLCPCB; MPN: CL10A106KP8NNNC; MPNAlt: C19702; MntType: SMD; Tolerance: 10%; MSL: MSL 1; Package: =Footprint; RoHS: Comply; PartType: CHIP CERAMIC CAPACITOR; Pins: 2; BOMDescription: =MntType+' '+PartType+' '+Package+' '+Value+' '+Tolerance+' '+Voltage+' '+TempCoeff+' '+MPN; CFootprint: =Footprint; Voltage: 10V; Part Number: CAPC; ClassName: Capacitor; ComponentLink1Description: Datasheet; ComponentLink1Description: New link; ComponentLink1URL: https://datasheet.lcsc.com/lcsc/1810191219_Samsung-Electro-Mechanics-CL10A106KP8NNNC_C19702.pdf
DD2 = CDCM61004: MANUFACTURER: Texas Instruments; MNTTYPE: SMD; PART NUMBER: CDCM61004; MPN: CDCM61004; MSL: MSL 1; PACKAGE: VQFN32; ROHS: Comply; PARTTYPE: PLL; PINS: 32; BOMDESCRIPTION: =MntType+' '+PartType+' '+Package+' '+Value+' '+Tolerance+' '+Voltage+' '+TempCoeff+' '+MPN; CFOOTPRINT: =Footprint; CLASSNAME: PLL; COMPONENTLINK1DESCRIPTION: Datasheet; COMPONENTLINK1URL: https://www.ti.com/lit/ds/symlink/cdcm61004.pdf
G1 = LFTVXO076346REEL: MANUFACTURER: IQD; MNTTYPE: SMD; ComponentLink1Description: Datasheet; MPN: LFTVXO076346REEL; PART NUMBER: LFTVXO076346REEL; MSL: SML 1; PACKAGE: =Footprint; ROHS: Comply; PARTTYPE: VCTCXO; PINS: 6; BOMDESCRIPTION: =MntType+' '+PartType+' '+Package+' '+Value+' '+Tolerance+' '+Voltage+' '+TempCoeff+' '+MPN; CFOOTPRINT: =Footprint; COMPONENTLINK1URL: https://nl.mouser.com/datasheet/2/741/LFTVXO076346Reel-1148098.pdf
L5 = PBY201209T-121Y-N: Manufacturer: Chilisin Elec; ManufacturerAlt: JLCPCB; MPNAlt: C142063; MntType: SMD; BOMDescription: SMD INDUCTOR 0805 120R @ 100MHz    PBY201209T-121Y-N; MPN: PBY201209T-121Y-N; MSL: MSL 1; Package: 0805; RoHS: Comply; PartType: INDUCTOR; Pins: 2; CFootprint: =Footprint; Part Number: PBY201209T-121Y-N; ClassName: Inductor; ComponentLink1Description: Datasheet; ComponentLink1URL: https://datasheet.lcsc.com/lcsc/1810261221_Chilisin-Elec-PBY201209T-121Y-N_C142063.pdf
R14 R23 = RES0402: Manufacturer: UNI-ROYAL(Uniroyal Elec); ManufacturerAlt: JLCPCB; MPN: 0402WGF1002TCE; MPNAlt: C25744; MntType: SMD; MSL: MSL 1; Package: =Footprint; RoHS: Comply; PartType: CHIP RESISTOR; Pins: 2; BOMDescription: =MntType+' '+PartType+' '+Package+' '+Value+' '+Tolerance+' '+Voltage+' '+TempCoeff+' '+MPN; CFootprint: =Footprint; Value: 10к; Part Number: RES0402; ClassName: Resistor; ComponentLink1Description: Datasheet
R16-R22 = RES0402: Manufacturer: UNI-ROYAL(Uniroyal Elec); ManufacturerAlt: JLCPCB; MPN: 0402WGF0000TCE; MPNAlt: C17168; MntType: SMD; MSL: MSL 1; Package: =Footprint; RoHS: Comply; PartType: CHIP RESISTOR; Pins: 2; BOMDescription: =MntType+' '+PartType+' '+Package+' '+Value+' '+Tolerance+' '+Voltage+' '+TempCoeff+' '+MPN; CFootprint: =Footprint; Part Number: RES0402; ClassName: Resistor; ComponentLink1Description: Datasheet; ComponentLink1Description: New link; ComponentLink1URL: https://datasheet.lcsc.com/lcsc/2110251730_UNI-ROYAL-Uniroyal-Elec-0402WGF0000TCE_C17168.pdf
  R16-R19 R21: Value: DNI
  R20 R22: Value: 0
R24 = RES: MntType: SMD; MSL: MSL 1; Package: =Footprint; RoHS: Comply; PartType: CHIP RESISTOR; Pins: 2; BOMDescription: =MntType+' '+PartType+' '+Package+' '+Value+' '+Tolerance+' '+Voltage+' '+TempCoeff+' '+MPN; CFootprint: =Footprint; Value: 5.1к; PART NUMBER: RES; CLASSNAME: Resistor; COMPONENTLINK1DESCRIPTION: Datasheet
R53 = TRIM_3006P-1-103LF: MANUFACTURER: Bourns; MNTTYPE: TH; ComponentLink1Description: Datasheet; PART NUMBER: TRIM_3006P-1-103LF; MPN: TRIM_3006P-1-103LF; MSL: MSL 1; PACKAGE: = Footprint; ROHS: Comply; PARTTYPE: RES; PINS: 3; BOMDESCRIPTION: =MntType+' '+PartType+' '+Package+' '+Value+' '+Tolerance+' '+Voltage+' '+TempCoeff+' '+MPN; CFOOTPRINT: =Footprint; COMPONENTLINK1URL: https://static.chipdip.ru/lib/948/DOC011948535.pdf
X2 X3 = SMA_WR_60311042114502: MANUFACTURER: WE; MNTTYPE: SMD; PART NUMBER: SMA_WR_60311042114502; MPN: 60311042114502; MSL: MSL 1; ROHS: Comply; PARTTYPE: SMA; PINS: 5; BOMDESCRIPTION: =MntType+' '+PartType+' '+Package+' '+Value+' '+Tolerance+' '+Voltage+' '+TempCoeff+' '+MPN; CFOOTPRINT: =Footprint; CLASSNAME: SMA; COMPONENTLINK1DESCRIPTION: Datasheet; COMPONENTLINK1URL: https://katalog.we-online.de/em/datasheet/60311042114502.pdf
X11 = PAD-CONNECT-MINI: MntType: SMD; MSL: MSL 1; RoHS: Comply; BOMDescription: SMD; CFootprint: =Footprint; PART NUMBER: PAD-CONNECT-MINI; CLASSNAME: Test_Point; COMPONENTLINK1DESCRIPTION: Datasheet

## Nets that join several sheets
+1V3: FPGA (R54.2 R55.2 R58.2 R59.2), Power (C70.2 DA8.4), A13 (A13.C56.2 A13.DA5.8), A14 (A14.C56.2 A14.DA5.8)
+3V3: FPGA (27 pins), FLASH (C30.2 D4.8 R25.1 R26.1), A7 (A7.C40.2 A7.C41.2 A7.DA4.1 A7.DA4.2), FTDI (15 pins), Power (11 pins), A10 (8 pins), A8 (A8.C40.2 A8.C41.2 A8.DA4.1 A8.DA4.2), A12 (8 pins), A6 (A6.C40.2 A6.C41.2 A6.DA4.1 A6.DA4.2), A9 (A9.C40.2 A9.C41.2 A9.DA4.1 A9.DA4.2), ClockGen (18 pins)
+3V3_Analog: Power (C39.1 DA3.2 DA3.4 R33.2), A13 (A13.C60.1 A13.C61.1 A13.DA5.9 A13.DA5.12), A14 (A14.C60.1 A14.C61.1 A14.DA5.9 A14.DA5.12)
+5V: Power (C32.2 DA1.3 R28.1), A13 (A13.C57.1 A13.C58.1 A13.DA5.5 A13.DA5.16), A14 (A14.C57.1 A14.C58.1 A14.DA5.5 A14.DA5.16)
-5V: Power (C34.2 D6.1 DA1.9), A13 (A13.C59.1 A13.DA5.13), A14 (A14.C59.1 A14.DA5.13)
Fused_5V: Power (15 pins), OpAmp (C66.2 DA6.8)
GND: TopLevel (12 pins), FPGA (30 pins), FLASH (C30.1 D4.4 R27.1), A7 (A7.C40.1 A7.C41.1 A7.DA4.8), FTDI (31 pins), Power (33 pins), A13 (11 pins), A10 (9 pins), A8 (A8.C40.1 A8.C41.1 A8.DA4.8), A12 (9 pins), A14 (11 pins), A6 (A6.C40.1 A6.C41.1 A6.DA4.8), A9 (A9.C40.1 A9.C41.1 A9.DA4.8), OpAmp (C66.1 DA6.4 R50.1 R52.1), ClockGen (32 pins)
~{CS}: FPGA (D1.60), FLASH (D4.1)
Clock_N: FPGA (D1.36 R15.1), ClockGen (DD2.5)
Clock_P: FPGA (D1.35 R15.2), ClockGen (DD2.6)
Comp_1_N: FPGA (D1.40 R55.1), A13 (A13.DA5.10)
Comp_1_P: FPGA (D1.39 R54.1), A13 (A13.DA5.11)
Comp_2_N: FPGA (D1.26 R59.1), A14 (A14.DA5.10)
Comp_2_P: FPGA (D1.25 R58.1), A14 (A14.DA5.11)
DAC1_SPI_~{CS}: FPGA (D1.20), A7 (A7.DA4.5)
DAC1_SPI_MCLK: FPGA (D1.19), A7 (A7.DA4.6)
DAC1_SPI_MOSI: FPGA (D1.18), A7 (A7.DA4.7)
DAC1_X_SPI_~{CS}: FPGA (D1.37), A6 (A6.DA4.5)
DAC1_X_SPI_MCLK: FPGA (D1.33), A6 (A6.DA4.6)
DAC1_X_SPI_MOSI: FPGA (D1.32), A6 (A6.DA4.7)
DAC2_SPI_~{CS}: FPGA (D1.17), A8 (A8.DA4.5)
DAC2_SPI_MCLK: FPGA (D1.16), A8 (A8.DA4.6)
DAC2_SPI_MOSI: FPGA (D1.15), A8 (A8.DA4.7)
DAC2_X_SPI_~{CS}: FPGA (D1.31), A9 (A9.DA4.5)
DAC2_X_SPI_MCLK: FPGA (D1.30), A9 (A9.DA4.6)
DAC2_X_SPI_MOSI: FPGA (D1.29), A9 (A9.DA4.7)
Delay1_0: FPGA (D1.48), A10 (A10.DD7.2)
Delay1_1: FPGA (D1.49), A10 (A10.DD7.1)
Delay1_2: FPGA (D1.50), A10 (A10.DD7.32)
Delay1_3: FPGA (D1.51), A10 (A10.DD7.31)
Delay1_4: FPGA (D1.52), A10 (A10.DD7.30)
Delay1_5: FPGA (D1.53), A10 (A10.DD7.29)
Delay1_6: FPGA (D1.54), A10 (A10.DD7.27)
Delay1_7: FPGA (D1.55), A10 (A10.DD7.26)
Delay1_8: FPGA (D1.56), A10 (A10.DD7.25)
Delay1_9: FPGA (D1.57), A10 (A10.DD7.23)
Delay2_0: FPGA (D1.68), A12 (A12.DD7.2)
Delay2_1: FPGA (D1.69), A12 (A12.DD7.1)
Delay2_2: FPGA (D1.70), A12 (A12.DD7.32)
Delay2_3: FPGA (D1.71), A12 (A12.DD7.31)
Delay2_4: FPGA (D1.72), A12 (A12.DD7.30)
Delay2_5: FPGA (D1.73), A12 (A12.DD7.29)
Delay2_6: FPGA (D1.74), A12 (A12.DD7.27)
Delay2_7: FPGA (D1.75), A12 (A12.DD7.26)
Delay2_8: FPGA (D1.76), A12 (A12.DD7.25)
Delay2_9: FPGA (D1.77), A12 (A12.DD7.23)
Delayed_DelayLine1_N: A13 (A13.R43.2), A10 (A10.DD7.20)
Delayed_DelayLine1_N: A12 (A12.DD7.20), A14 (A14.R43.2)
Delayed_DelayLine1_P: A13 (A13.R44.2), A10 (A10.DD7.21)
Delayed_DelayLine1_P: A12 (A12.DD7.21), A14 (A14.R44.2)
Enable_1: FPGA (D1.47), A10 (A10.DD7.10)
Enable_2: FPGA (D1.63), A12 (A12.DD7.10)
JTAG_TCK: FPGA (D1.6), FTDI (DD6.5 R41.1)
JTAG_TDI: FPGA (D1.7), FTDI (DD6.4 R40.1)
JTAG_TDO: FPGA (D1.8), FTDI (DD6.2 R39.1)
JTAG_TMS: FPGA (D1.5), FTDI (DD6.1 R38.1)
MCLK: FPGA (D1.59), FLASH (D4.6 R27.2)
MISO: FPGA (D1.62), FLASH (D4.2)
MOSI: FPGA (D1.61), FLASH (D4.5)
NetA6.DA4_3: A10 (A10.DD7.17), A6 (A6.DA4.3 A6.DA4.4)
NetA7.DA4_3: A7 (A7.DA4.3 A7.DA4.4), OpAmp (DA6.5)
NetA8.DA4_3: A8 (A8.DA4.3 A8.DA4.4), OpAmp (DA6.3)
NetA9.DA4_3: A12 (A12.DD7.17), A9 (A9.DA4.3 A9.DA4.4)
NetA13.C55_1: A13 (A13.C55.1 A13.DA5.3 A13.DA5.4), OpAmp (R51.1)
NetA14.C55_1: A14 (A14.C55.1 A14.DA5.3 A14.DA5.4), OpAmp (R49.1)
Node_Clk: TopLevel (X5.1), FPGA (D1.11)
SMA_Voltage_1: TopLevel (X4.1), A13 (A13.DA5.2)
SMA_Voltage_2: TopLevel (X6.1), A14 (A14.DA5.2)
SPI_CS: FPGA (D1.83), FTDI (DD4.41)
SPI_DI: FPGA (D1.84), FTDI (DD4.40)
Trigger1_N: FPGA (D1.41), A10 (A10.DD7.5 A10.R48.1)
Trigger1_P: FPGA (D1.42), A10 (A10.DD7.4 A10.R48.2)
Trigger2_N: FPGA (D1.27), A12 (A12.DD7.5 A12.R48.1)
Trigger2_P: FPGA (D1.28), A12 (A12.DD7.4 A12.R48.2)
UART_RX_SPI_DO: FPGA (D1.85), FTDI (DD4.39)
UART_TX_SPI_CLK: FPGA (D1.86), FTDI (DD4.38)